# Altium schematic sheet imgCargas.SchDoc
size A
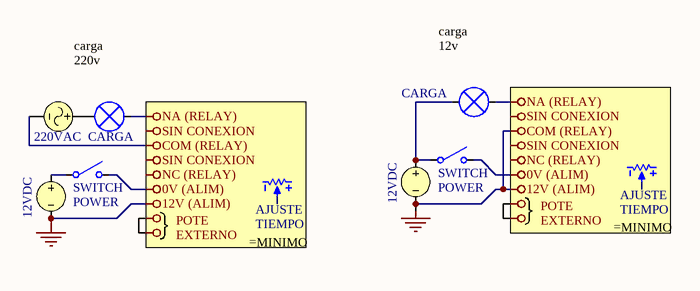
[diagram p0: imgCargas.SchDoc]

## Parts
(Parts that share a designator on the sheet are numbered #1, #2 ... from top to bottom, then left to right.)
CARGA#1  Lamp  [bornera2]  (value not drawn)
CARGA#2  Lamp  [bornera2]  (value not drawn)
R?#1  Set Position: AJUSTE  [conpol4x1]  (hidden comment: RVar)  (part A of 2)
R?#2  Set Position: AJUSTE  [conpol4x1]  (hidden comment: RVar)  (part A of 2)
SWITCH#1  Price: POWER  [PULSADOR200TH]  (hidden comment: SW)
SWITCH#2  Price: POWER  [PULSADOR200TH]  (hidden comment: SW)
V?#1  220VAC
V?#2  12VDC
V?#3  12VDC

## Nets
0V (ALIM): SWITCH#1.1 SWITCH#2.1
12V (ALIM): V?#1.2  [also labelled COM (RELAY), GND]
NA (RELAY): CARGA#1.2 CARGA#2.2
NetCARGA#1_1: CARGA#1.1 SWITCH#1.2 V?#2.1
NetCARGA#2_1: CARGA#2.1 V?#1.1
NetSWITCH#2_2: SWITCH#2.2 V?#3.1

Not connected (* = marked no-connect by the designer): R?#1 1 2 3; R?#2 1 2 3; V?#2 2; V?#3 2

## Notes on the sheet
- carga 220v
- (near CARGA#1) carga 12v
- (near R?#2) POTE EXTERNO
- (near R?#1) POTE EXTERNO
- Labels drawn without touching a wire or pin: NC (RELAY), SIN CONEXION
- (in symbol RVar, part A) TIEMPO

## Library data of the parts
CARGA#1 CARGA#2 = Lamp: Indicator; Price: ?
R?#1 R?#2 = RVar: Resistencia Variable
SWITCH#1 SWITCH#2 = SW: Switch
V?#1 = VSIN: Sinusoidal Voltage Source; Note: PCB Footprint - Not required; Published: 8-Jun-2000; LatestRevisionDate: 15-Nov-2004; LatestRevisionNote: Corrected Netlist.; PackageReference: Not Applicable; Publisher: Altium Limited
V?#2 V?#3 = VSRC: Voltage Source; Note: PCB Footprint - Not required; Published: 8-Jun-2000; LatestRevisionDate: 17-Jul-2002; LatestRevisionNote: Re-released for DXP Platform.; PackageReference: Not Applicable; Publisher: Altium Limited